# EAGLE design rack_backplane_v9.0 (EAGLE 9.6.2)
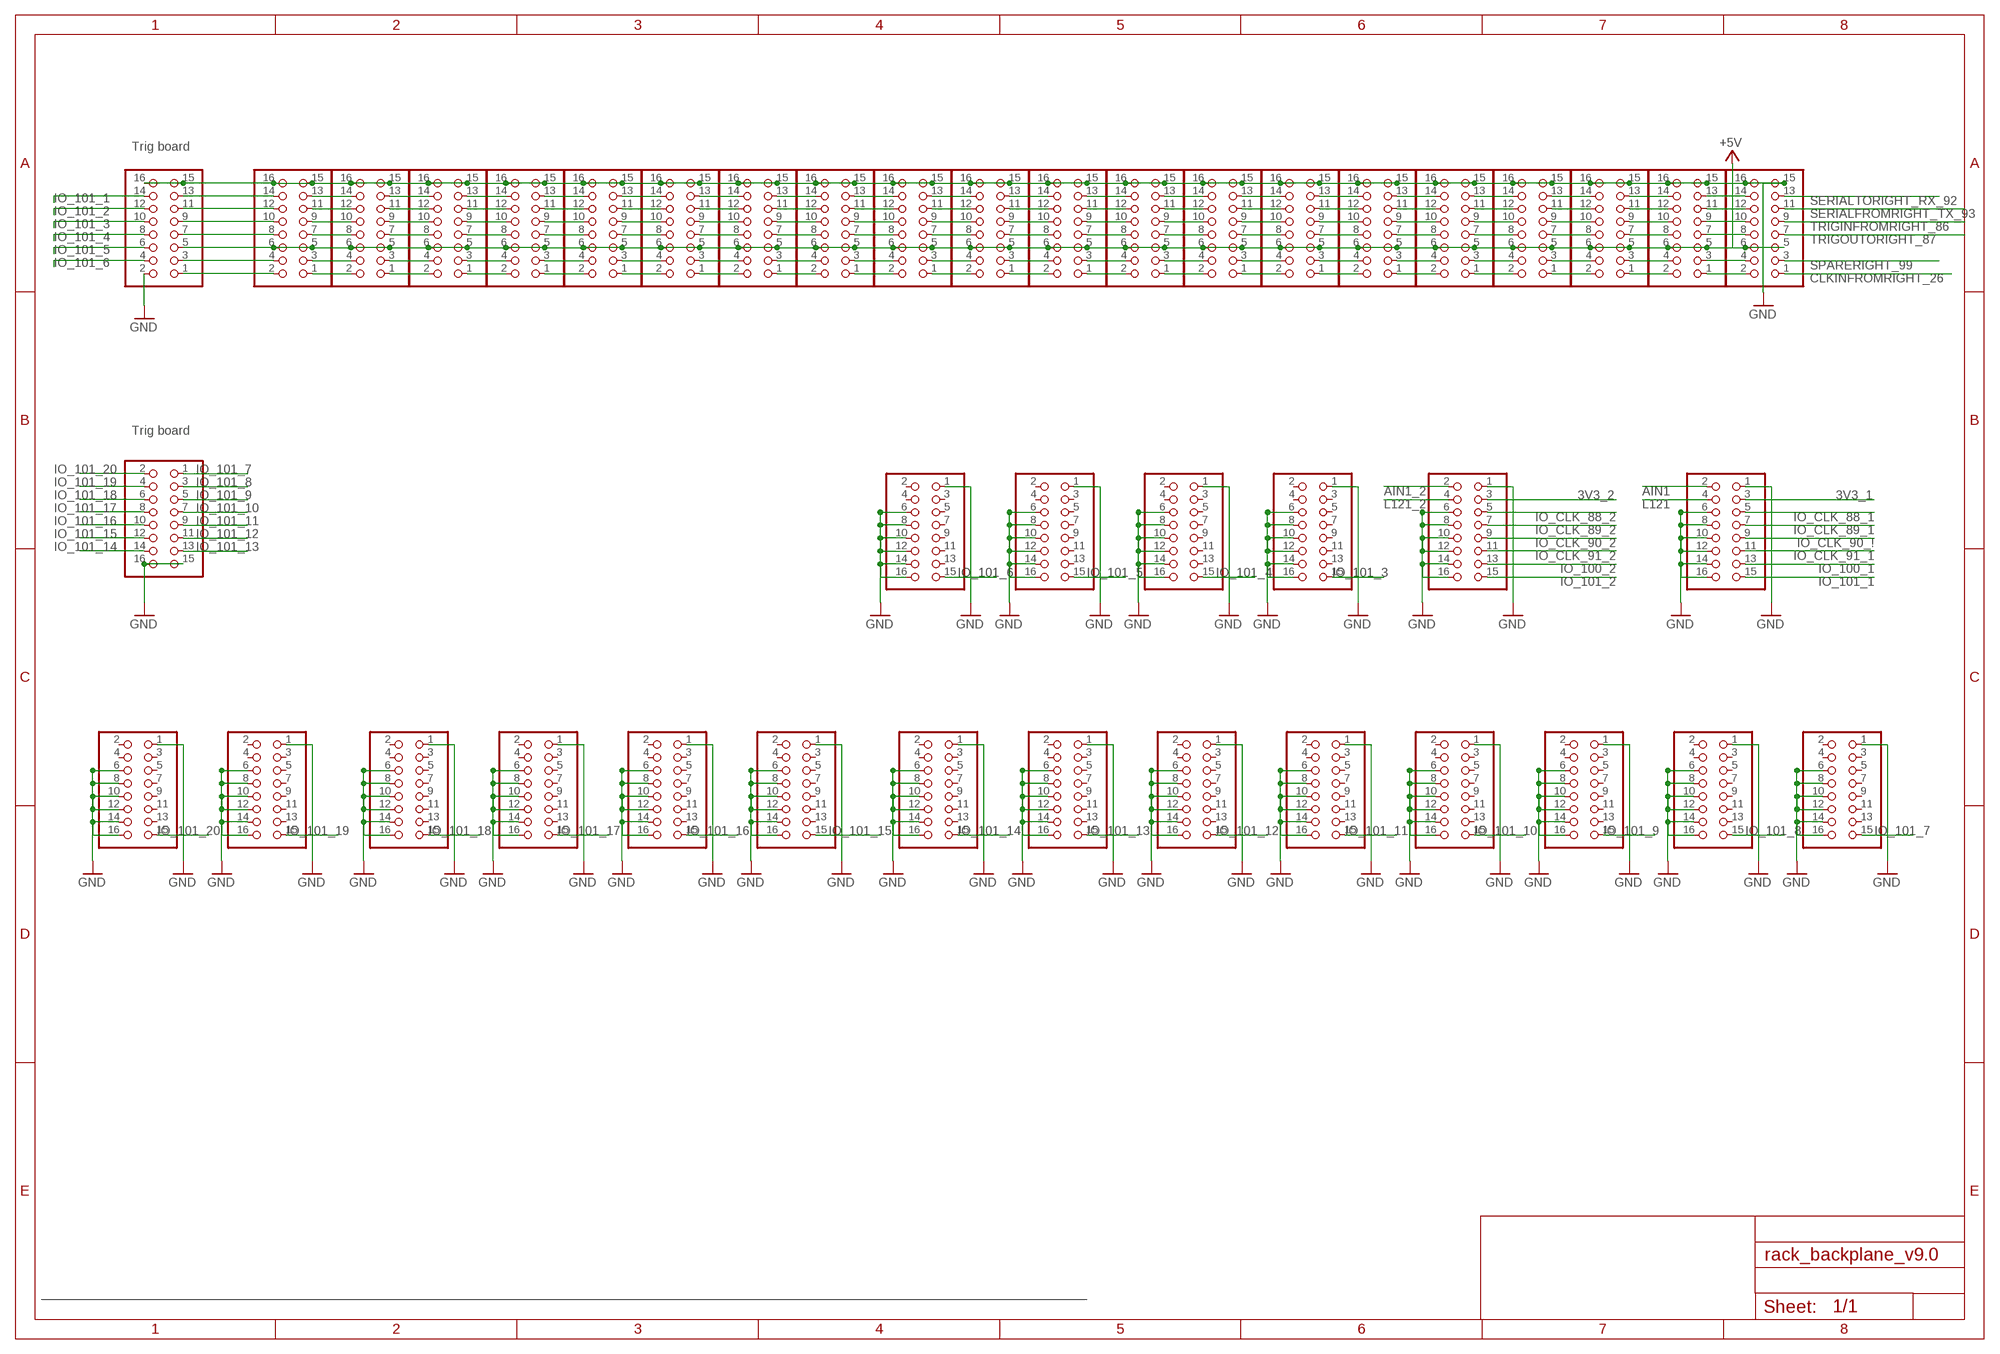
[diagram p0: schematic, sheet 1]

## Parts
PIN_AIN_PWRGND1  15-91-2160  PINHD-2X8  [2X08]
PIN_AIN_PWRGND2  15-91-2160  PINHD-2X8  [2X08]
PIN_AIN_PWRGND3  15-91-2160  PINHD-2X8  [2X08]
PIN_AIN_PWRGND4  15-91-2160  PINHD-2X8  [2X08]
PIN_AIN_PWRGND5  15-91-2160  PINHD-2X8  [2X08]
PIN_AIN_PWRGND6  15-91-2160  PINHD-2X8  [2X08]
PIN_AIN_PWRGND7  15-91-2160  PINHD-2X8  [2X08]
PIN_AIN_PWRGND8  15-91-2160  PINHD-2X8  [2X08]
PIN_AIN_PWRGND9  15-91-2160  PINHD-2X8  [2X08]
PIN_AIN_PWRGND10  15-91-2160  PINHD-2X8  [2X08]
PIN_AIN_PWRGND11  15-91-2160  PINHD-2X8  [2X08]
PIN_AIN_PWRGND12  15-91-2160  PINHD-2X8  [2X08]
PIN_AIN_PWRGND13  15-91-2160  PINHD-2X8  [2X08]
PIN_AIN_PWRGND14  15-91-2160  PINHD-2X8  [2X08]
PIN_AIN_PWRGND15  15-91-2160  PINHD-2X8  [2X08]
PIN_AIN_PWRGND16  15-91-2160  PINHD-2X8  [2X08]
PIN_AIN_PWRGND17  15-91-2160  PINHD-2X8  [2X08]
PIN_AIN_PWRGND18  15-91-2160  PINHD-2X8  [2X08]
PIN_AIN_PWRGND19  15-91-2160  PINHD-2X8  [2X08]
PIN_AIN_PWRGND20  15-91-2160  PINHD-2X8  [2X08]
PIN_AIN_PWRGND21  15-91-2160  PINHD-2X8  [2X08]
PIN_ANALOG_1  15-91-2160  PINHD-2X8  [2X08]
PIN_ANALOG_2  15-91-2160  PINHD-2X8  [2X08]
PIN_ANALOG_3  15-91-2160  PINHD-2X8  [2X08]
PIN_ANALOG_4  15-91-2160  PINHD-2X8  [2X08]
PIN_ANALOG_5  15-91-2160  PINHD-2X8  [2X08]
PIN_ANALOG_6  15-91-2160  PINHD-2X8  [2X08]
PIN_ANALOG_7  15-91-2160  PINHD-2X8  [2X08]
PIN_ANALOG_8  15-91-2160  PINHD-2X8  [2X08]
PIN_ANALOG_9  15-91-2160  PINHD-2X8  [2X08]
PIN_ANALOG_10  15-91-2160  PINHD-2X8  [2X08]
PIN_ANALOG_11  15-91-2160  PINHD-2X8  [2X08]
PIN_ANALOG_12  15-91-2160  PINHD-2X8  [2X08]
PIN_ANALOG_13  15-91-2160  PINHD-2X8  [2X08]
PIN_ANALOG_14  15-91-2160  PINHD-2X8  [2X08]
PIN_ANALOG_15  15-91-2160  PINHD-2X8  [2X08]
PIN_ANALOG_16  15-91-2160  PINHD-2X8  [2X08]
PIN_ANALOG_17  15-91-2160  PINHD-2X8  [2X08]
PIN_ANALOG_18  15-91-2160  PINHD-2X8  [2X08]
PIN_ANALOG_19  15-91-2160  PINHD-2X8  [2X08]
PIN_ANALOG_20  15-91-2160  PINHD-2X8  [2X08]
PIN_ANALOG_21  15-91-2160  PINHD-2X8  [2X08]

## Nets
3V3_1 [three]: PIN_AIN_PWRGND1.3
3V3_2 [three]: PIN_AIN_PWRGND2.3
+5V [five]: PIN_ANALOG_1.5 PIN_ANALOG_1.6 PIN_ANALOG_2.5 PIN_ANALOG_2.6 PIN_ANALOG_3.5 PIN_ANALOG_3.6 PIN_ANALOG_4.5 PIN_ANALOG_4.6 PIN_ANALOG_5.5 PIN_ANALOG_5.6 PIN_ANALOG_6.5 PIN_ANALOG_6.6 PIN_ANALOG_7.5 PIN_ANALOG_7.6 PIN_ANALOG_8.5 PIN_ANALOG_8.6 PIN_ANALOG_9.5 PIN_ANALOG_9.6 PIN_ANALOG_10.5 PIN_ANALOG_10.6 PIN_ANALOG_11.5 PIN_ANALOG_11.6 PIN_ANALOG_12.5 PIN_ANALOG_12.6 PIN_ANALOG_13.5 PIN_ANALOG_13.6 PIN_ANALOG_14.5 PIN_ANALOG_14.6 PIN_ANALOG_15.5 PIN_ANALOG_15.6 PIN_ANALOG_16.5 PIN_ANALOG_16.6 PIN_ANALOG_17.5 PIN_ANALOG_17.6 PIN_ANALOG_18.5 PIN_ANALOG_18.6 PIN_ANALOG_19.5 PIN_ANALOG_19.6 PIN_ANALOG_20.5 PIN_ANALOG_20.6 PIN_ANALOG_21.5
AIN1: PIN_AIN_PWRGND1.2
AIN1_2: PIN_AIN_PWRGND2.2
CLKINFROMRIGHT_26: PIN_ANALOG_1.1
GND [gnd]: PIN_AIN_PWRGND1.1 PIN_AIN_PWRGND1.6 PIN_AIN_PWRGND1.8 PIN_AIN_PWRGND1.10 PIN_AIN_PWRGND1.12 PIN_AIN_PWRGND1.14 PIN_AIN_PWRGND1.16 PIN_AIN_PWRGND2.1 PIN_AIN_PWRGND2.6 PIN_AIN_PWRGND2.8 PIN_AIN_PWRGND2.10 PIN_AIN_PWRGND2.12 PIN_AIN_PWRGND2.14 PIN_AIN_PWRGND2.16 PIN_AIN_PWRGND3.1 PIN_AIN_PWRGND3.6 PIN_AIN_PWRGND3.8 PIN_AIN_PWRGND3.10 PIN_AIN_PWRGND3.12 PIN_AIN_PWRGND3.14 PIN_AIN_PWRGND3.16 PIN_AIN_PWRGND4.1 PIN_AIN_PWRGND4.6 PIN_AIN_PWRGND4.8 PIN_AIN_PWRGND4.10 PIN_AIN_PWRGND4.12 PIN_AIN_PWRGND4.14 PIN_AIN_PWRGND4.16 PIN_AIN_PWRGND5.1 PIN_AIN_PWRGND5.6 PIN_AIN_PWRGND5.8 PIN_AIN_PWRGND5.10 PIN_AIN_PWRGND5.12 PIN_AIN_PWRGND5.14 PIN_AIN_PWRGND5.16 PIN_AIN_PWRGND6.1 PIN_AIN_PWRGND6.6 PIN_AIN_PWRGND6.8 PIN_AIN_PWRGND6.10 PIN_AIN_PWRGND6.12 PIN_AIN_PWRGND6.14 PIN_AIN_PWRGND6.16 PIN_AIN_PWRGND7.1 PIN_AIN_PWRGND7.6 PIN_AIN_PWRGND7.8 PIN_AIN_PWRGND7.10 PIN_AIN_PWRGND7.12 PIN_AIN_PWRGND7.14 PIN_AIN_PWRGND7.16 PIN_AIN_PWRGND8.1 PIN_AIN_PWRGND8.6 PIN_AIN_PWRGND8.8 PIN_AIN_PWRGND8.10 PIN_AIN_PWRGND8.12 PIN_AIN_PWRGND8.14 PIN_AIN_PWRGND8.16 PIN_AIN_PWRGND9.1 PIN_AIN_PWRGND9.6 PIN_AIN_PWRGND9.8 PIN_AIN_PWRGND9.10 PIN_AIN_PWRGND9.12 PIN_AIN_PWRGND9.14 PIN_AIN_PWRGND9.16 PIN_AIN_PWRGND10.1 PIN_AIN_PWRGND10.6 PIN_AIN_PWRGND10.8 PIN_AIN_PWRGND10.10 PIN_AIN_PWRGND10.12 PIN_AIN_PWRGND10.14 PIN_AIN_PWRGND10.16 PIN_AIN_PWRGND11.1 PIN_AIN_PWRGND11.6 PIN_AIN_PWRGND11.8 PIN_AIN_PWRGND11.10 PIN_AIN_PWRGND11.12 PIN_AIN_PWRGND11.14 PIN_AIN_PWRGND11.16 PIN_AIN_PWRGND12.1 PIN_AIN_PWRGND12.6 PIN_AIN_PWRGND12.8 PIN_AIN_PWRGND12.10 PIN_AIN_PWRGND12.12 PIN_AIN_PWRGND12.14 PIN_AIN_PWRGND12.16 PIN_AIN_PWRGND13.1 PIN_AIN_PWRGND13.6 PIN_AIN_PWRGND13.8 PIN_AIN_PWRGND13.10 PIN_AIN_PWRGND13.12 PIN_AIN_PWRGND13.14 PIN_AIN_PWRGND13.16 PIN_AIN_PWRGND14.1 PIN_AIN_PWRGND14.6 PIN_AIN_PWRGND14.8 PIN_AIN_PWRGND14.10 PIN_AIN_PWRGND14.12 PIN_AIN_PWRGND14.14 PIN_AIN_PWRGND14.16 PIN_AIN_PWRGND15.1 PIN_AIN_PWRGND15.6 PIN_AIN_PWRGND15.8 PIN_AIN_PWRGND15.10 PIN_AIN_PWRGND15.12 PIN_AIN_PWRGND15.14 PIN_AIN_PWRGND15.16 PIN_AIN_PWRGND16.1 PIN_AIN_PWRGND16.6 PIN_AIN_PWRGND16.8 PIN_AIN_PWRGND16.10 PIN_AIN_PWRGND16.12 PIN_AIN_PWRGND16.14 PIN_AIN_PWRGND16.16 PIN_AIN_PWRGND17.1 PIN_AIN_PWRGND17.6 PIN_AIN_PWRGND17.8 PIN_AIN_PWRGND17.10 PIN_AIN_PWRGND17.12 PIN_AIN_PWRGND17.14 PIN_AIN_PWRGND17.16 PIN_AIN_PWRGND18.1 PIN_AIN_PWRGND18.6 PIN_AIN_PWRGND18.8 PIN_AIN_PWRGND18.10 PIN_AIN_PWRGND18.12 PIN_AIN_PWRGND18.14 PIN_AIN_PWRGND18.16 PIN_AIN_PWRGND19.1 PIN_AIN_PWRGND19.6 PIN_AIN_PWRGND19.8 PIN_AIN_PWRGND19.10 PIN_AIN_PWRGND19.12 PIN_AIN_PWRGND19.14 PIN_AIN_PWRGND19.16 PIN_AIN_PWRGND20.1 PIN_AIN_PWRGND20.6 PIN_AIN_PWRGND20.8 PIN_AIN_PWRGND20.10 PIN_AIN_PWRGND20.12 PIN_AIN_PWRGND20.14 PIN_AIN_PWRGND20.16 PIN_AIN_PWRGND21.15 PIN_AIN_PWRGND21.16 PIN_ANALOG_1.15 PIN_ANALOG_1.16 PIN_ANALOG_2.15 PIN_ANALOG_2.16 PIN_ANALOG_3.15 PIN_ANALOG_3.16 PIN_ANALOG_4.15 PIN_ANALOG_4.16 PIN_ANALOG_5.15 PIN_ANALOG_5.16 PIN_ANALOG_6.15 PIN_ANALOG_6.16 PIN_ANALOG_7.15 PIN_ANALOG_7.16 PIN_ANALOG_8.15 PIN_ANALOG_8.16 PIN_ANALOG_9.15 PIN_ANALOG_9.16 PIN_ANALOG_10.15 PIN_ANALOG_10.16 PIN_ANALOG_11.15 PIN_ANALOG_11.16 PIN_ANALOG_12.15 PIN_ANALOG_12.16 PIN_ANALOG_13.15 PIN_ANALOG_13.16 PIN_ANALOG_14.15 PIN_ANALOG_14.16 PIN_ANALOG_15.15 PIN_ANALOG_15.16 PIN_ANALOG_16.15 PIN_ANALOG_16.16 PIN_ANALOG_17.15 PIN_ANALOG_17.16 PIN_ANALOG_18.15 PIN_ANALOG_18.16 PIN_ANALOG_19.15 PIN_ANALOG_19.16 PIN_ANALOG_20.15 PIN_ANALOG_20.16 PIN_ANALOG_21.2 PIN_ANALOG_21.15 PIN_ANALOG_21.16
IO_100_1: PIN_AIN_PWRGND1.13
IO_100_2: PIN_AIN_PWRGND2.13
IO_101_1 [50ohm]: PIN_AIN_PWRGND1.15 PIN_ANALOG_21.14
IO_101_2 [50ohm]: PIN_AIN_PWRGND2.15 PIN_ANALOG_21.12
IO_101_3 [50ohm]: PIN_AIN_PWRGND3.15 PIN_ANALOG_21.10
IO_101_4 [50ohm]: PIN_AIN_PWRGND4.15 PIN_ANALOG_21.8
IO_101_5 [50ohm]: PIN_AIN_PWRGND5.15 PIN_ANALOG_21.6
IO_101_6 [50ohm]: PIN_AIN_PWRGND6.15 PIN_ANALOG_21.4
IO_101_7 [50ohm]: PIN_AIN_PWRGND7.15 PIN_AIN_PWRGND21.1
IO_101_8 [50ohm]: PIN_AIN_PWRGND8.15 PIN_AIN_PWRGND21.3
IO_101_9 [50ohm]: PIN_AIN_PWRGND9.15 PIN_AIN_PWRGND21.5
IO_101_10 [50ohm]: PIN_AIN_PWRGND10.15 PIN_AIN_PWRGND21.7
IO_101_11 [50ohm]: PIN_AIN_PWRGND11.15 PIN_AIN_PWRGND21.9
IO_101_12 [50ohm]: PIN_AIN_PWRGND12.15 PIN_AIN_PWRGND21.11
IO_101_13 [50ohm]: PIN_AIN_PWRGND13.15 PIN_AIN_PWRGND21.13
IO_101_14 [50ohm]: PIN_AIN_PWRGND14.15 PIN_AIN_PWRGND21.14
IO_101_15 [50ohm]: PIN_AIN_PWRGND15.15 PIN_AIN_PWRGND21.12
IO_101_16 [50ohm]: PIN_AIN_PWRGND16.15 PIN_AIN_PWRGND21.10
IO_101_17 [50ohm]: PIN_AIN_PWRGND17.15 PIN_AIN_PWRGND21.8
IO_101_18 [50ohm]: PIN_AIN_PWRGND18.15 PIN_AIN_PWRGND21.6
IO_101_19 [50ohm]: PIN_AIN_PWRGND19.15 PIN_AIN_PWRGND21.4
IO_101_20 [50ohm]: PIN_AIN_PWRGND20.15 PIN_AIN_PWRGND21.2
IO_CLK_88_1: PIN_AIN_PWRGND1.5
IO_CLK_88_2: PIN_AIN_PWRGND2.5
IO_CLK_89_1: PIN_AIN_PWRGND1.7
IO_CLK_89_2: PIN_AIN_PWRGND2.7
IO_CLK_90_2: PIN_AIN_PWRGND2.9
IO_CLK_90_!: PIN_AIN_PWRGND1.9
IO_CLK_91_1: PIN_AIN_PWRGND1.11
IO_CLK_91_2: PIN_AIN_PWRGND2.11
L121: PIN_AIN_PWRGND1.4
L121_2: PIN_AIN_PWRGND2.4
N$1: PIN_ANALOG_1.14 PIN_ANALOG_2.13
N$2: PIN_ANALOG_1.12 PIN_ANALOG_2.11
N$3: PIN_ANALOG_1.10 PIN_ANALOG_2.9
N$4: PIN_ANALOG_1.8 PIN_ANALOG_2.7
N$5: PIN_ANALOG_1.4 PIN_ANALOG_2.3
N$6: PIN_ANALOG_1.2 PIN_ANALOG_2.1
N$7: PIN_ANALOG_2.2 PIN_ANALOG_3.1
N$8: PIN_ANALOG_2.4 PIN_ANALOG_3.3
N$10: PIN_ANALOG_2.8 PIN_ANALOG_3.7
N$11: PIN_ANALOG_2.10 PIN_ANALOG_3.9
N$12: PIN_ANALOG_2.12 PIN_ANALOG_3.11
N$13: PIN_ANALOG_2.14 PIN_ANALOG_3.13
N$15: PIN_ANALOG_3.2 PIN_ANALOG_4.1
N$16: PIN_ANALOG_3.4 PIN_ANALOG_4.3
N$19: PIN_ANALOG_3.8 PIN_ANALOG_4.7
N$20: PIN_ANALOG_3.10 PIN_ANALOG_4.9
N$21: PIN_ANALOG_3.12 PIN_ANALOG_4.11
N$22: PIN_ANALOG_3.14 PIN_ANALOG_4.13
N$24: PIN_ANALOG_4.2 PIN_ANALOG_5.1
N$25: PIN_ANALOG_4.4 PIN_ANALOG_5.3
N$27: PIN_ANALOG_4.8 PIN_ANALOG_5.7
N$28: PIN_ANALOG_4.10 PIN_ANALOG_5.9
N$29: PIN_ANALOG_4.12 PIN_ANALOG_5.11
N$30: PIN_ANALOG_4.14 PIN_ANALOG_5.13
N$32: PIN_ANALOG_5.2 PIN_ANALOG_6.1
N$33: PIN_ANALOG_5.4 PIN_ANALOG_6.3
N$35: PIN_ANALOG_5.8 PIN_ANALOG_6.7
N$36: PIN_ANALOG_5.10 PIN_ANALOG_6.9
N$37: PIN_ANALOG_5.12 PIN_ANALOG_6.11
N$38: PIN_ANALOG_5.14 PIN_ANALOG_6.13
N$40: PIN_ANALOG_6.2 PIN_ANALOG_7.1
N$41: PIN_ANALOG_6.4 PIN_ANALOG_7.3
N$43: PIN_ANALOG_6.8 PIN_ANALOG_7.7
N$44: PIN_ANALOG_6.10 PIN_ANALOG_7.9
N$45: PIN_ANALOG_6.12 PIN_ANALOG_7.11
N$46: PIN_ANALOG_6.14 PIN_ANALOG_7.13
N$48: PIN_ANALOG_7.2 PIN_ANALOG_8.1
N$49: PIN_ANALOG_7.4 PIN_ANALOG_8.3
N$51: PIN_ANALOG_7.8 PIN_ANALOG_8.7
N$52: PIN_ANALOG_7.10 PIN_ANALOG_8.9
N$53: PIN_ANALOG_7.12 PIN_ANALOG_8.11
N$54: PIN_ANALOG_7.14 PIN_ANALOG_8.13
N$56: PIN_ANALOG_8.2 PIN_ANALOG_9.1
N$57: PIN_ANALOG_8.4 PIN_ANALOG_9.3
N$59: PIN_ANALOG_8.8 PIN_ANALOG_9.7
N$60: PIN_ANALOG_8.10 PIN_ANALOG_9.9
N$61: PIN_ANALOG_8.12 PIN_ANALOG_9.11
N$62: PIN_ANALOG_8.14 PIN_ANALOG_9.13
N$64: PIN_ANALOG_9.2 PIN_ANALOG_10.1
N$65: PIN_ANALOG_9.4 PIN_ANALOG_10.3
N$67: PIN_ANALOG_9.8 PIN_ANALOG_10.7
N$68: PIN_ANALOG_9.10 PIN_ANALOG_10.9
N$69: PIN_ANALOG_9.12 PIN_ANALOG_10.11
N$70: PIN_ANALOG_9.14 PIN_ANALOG_10.13
N$72: PIN_ANALOG_10.2 PIN_ANALOG_11.1
N$73: PIN_ANALOG_10.4 PIN_ANALOG_11.3
N$75: PIN_ANALOG_10.8 PIN_ANALOG_11.7
N$76: PIN_ANALOG_10.10 PIN_ANALOG_11.9
N$77: PIN_ANALOG_10.12 PIN_ANALOG_11.11
N$78: PIN_ANALOG_10.14 PIN_ANALOG_11.13
N$80: PIN_ANALOG_11.2 PIN_ANALOG_12.1
N$81: PIN_ANALOG_11.4 PIN_ANALOG_12.3
N$83: PIN_ANALOG_11.8 PIN_ANALOG_12.7
N$84: PIN_ANALOG_11.10 PIN_ANALOG_12.9
N$85: PIN_ANALOG_11.12 PIN_ANALOG_12.11
N$86: PIN_ANALOG_11.14 PIN_ANALOG_12.13
N$88: PIN_ANALOG_12.2 PIN_ANALOG_13.1
N$89: PIN_ANALOG_12.4 PIN_ANALOG_13.3
N$91: PIN_ANALOG_12.8 PIN_ANALOG_13.7
N$92: PIN_ANALOG_12.10 PIN_ANALOG_13.9
N$93: PIN_ANALOG_12.12 PIN_ANALOG_13.11
N$94: PIN_ANALOG_12.14 PIN_ANALOG_13.13
N$96: PIN_ANALOG_13.2 PIN_ANALOG_14.1
N$97: PIN_ANALOG_13.4 PIN_ANALOG_14.3
N$99: PIN_ANALOG_13.8 PIN_ANALOG_14.7
N$100: PIN_ANALOG_13.10 PIN_ANALOG_14.9
N$101: PIN_ANALOG_13.12 PIN_ANALOG_14.11
N$102: PIN_ANALOG_13.14 PIN_ANALOG_14.13
N$104: PIN_ANALOG_14.2 PIN_ANALOG_15.1
N$105: PIN_ANALOG_14.4 PIN_ANALOG_15.3
N$107: PIN_ANALOG_14.8 PIN_ANALOG_15.7
N$108: PIN_ANALOG_14.10 PIN_ANALOG_15.9
N$109: PIN_ANALOG_14.12 PIN_ANALOG_15.11
N$110: PIN_ANALOG_14.14 PIN_ANALOG_15.13
N$112: PIN_ANALOG_15.2 PIN_ANALOG_16.1
N$113: PIN_ANALOG_15.4 PIN_ANALOG_16.3
N$115: PIN_ANALOG_15.8 PIN_ANALOG_16.7
N$116: PIN_ANALOG_15.10 PIN_ANALOG_16.9
N$117: PIN_ANALOG_15.12 PIN_ANALOG_16.11
N$118: PIN_ANALOG_15.14 PIN_ANALOG_16.13
N$120: PIN_ANALOG_16.2 PIN_ANALOG_17.1
N$121: PIN_ANALOG_16.4 PIN_ANALOG_17.3
N$123: PIN_ANALOG_16.8 PIN_ANALOG_17.7
N$124: PIN_ANALOG_16.10 PIN_ANALOG_17.9
N$125: PIN_ANALOG_16.12 PIN_ANALOG_17.11
N$126: PIN_ANALOG_16.14 PIN_ANALOG_17.13
N$128: PIN_ANALOG_17.2 PIN_ANALOG_18.1
N$129: PIN_ANALOG_17.4 PIN_ANALOG_18.3
N$131: PIN_ANALOG_17.8 PIN_ANALOG_18.7
N$132: PIN_ANALOG_17.10 PIN_ANALOG_18.9
N$133: PIN_ANALOG_17.12 PIN_ANALOG_18.11
N$134: PIN_ANALOG_17.14 PIN_ANALOG_18.13
N$136: PIN_ANALOG_18.2 PIN_ANALOG_19.1
N$137: PIN_ANALOG_18.4 PIN_ANALOG_19.3
N$139: PIN_ANALOG_18.8 PIN_ANALOG_19.7
N$140: PIN_ANALOG_18.10 PIN_ANALOG_19.9
N$141: PIN_ANALOG_18.12 PIN_ANALOG_19.11
N$142: PIN_ANALOG_18.14 PIN_ANALOG_19.13
N$144: PIN_ANALOG_19.2 PIN_ANALOG_20.1
N$145: PIN_ANALOG_19.4 PIN_ANALOG_20.3
N$147: PIN_ANALOG_19.8 PIN_ANALOG_20.7
N$148: PIN_ANALOG_19.10 PIN_ANALOG_20.9
N$149: PIN_ANALOG_19.12 PIN_ANALOG_20.11
N$150: PIN_ANALOG_19.14 PIN_ANALOG_20.13
N$152: PIN_ANALOG_20.2 PIN_ANALOG_21.1
N$153: PIN_ANALOG_20.4 PIN_ANALOG_21.3
N$155: PIN_ANALOG_20.8 PIN_ANALOG_21.7
N$156: PIN_ANALOG_20.10 PIN_ANALOG_21.9
N$157: PIN_ANALOG_20.12 PIN_ANALOG_21.11
N$158: PIN_ANALOG_20.14 PIN_ANALOG_21.13
SERIALFROMRIGHT_TX_93: PIN_ANALOG_1.11
SERIALTORIGHT_RX_92: PIN_ANALOG_1.13
SPARERIGHT_99: PIN_ANALOG_1.3
TRIGINFROMRIGHT_86: PIN_ANALOG_1.9
TRIGOUTORIGHT_87: PIN_ANALOG_1.7
Unconnected: PIN_AIN_PWRGND3.2 PIN_AIN_PWRGND3.3 PIN_AIN_PWRGND3.4 PIN_AIN_PWRGND3.5 PIN_AIN_PWRGND3.7 PIN_AIN_PWRGND3.9 PIN_AIN_PWRGND3.11 PIN_AIN_PWRGND3.13 PIN_AIN_PWRGND4.2 PIN_AIN_PWRGND4.3 PIN_AIN_PWRGND4.4 PIN_AIN_PWRGND4.5 PIN_AIN_PWRGND4.7 PIN_AIN_PWRGND4.9 PIN_AIN_PWRGND4.11 PIN_AIN_PWRGND4.13 PIN_AIN_PWRGND5.2 PIN_AIN_PWRGND5.3 PIN_AIN_PWRGND5.4 PIN_AIN_PWRGND5.5 PIN_AIN_PWRGND5.7 PIN_AIN_PWRGND5.9 PIN_AIN_PWRGND5.11 PIN_AIN_PWRGND5.13 PIN_AIN_PWRGND6.2 PIN_AIN_PWRGND6.3 PIN_AIN_PWRGND6.4 PIN_AIN_PWRGND6.5 PIN_AIN_PWRGND6.7 PIN_AIN_PWRGND6.9 PIN_AIN_PWRGND6.11 PIN_AIN_PWRGND6.13 PIN_AIN_PWRGND7.2 PIN_AIN_PWRGND7.3 PIN_AIN_PWRGND7.4 PIN_AIN_PWRGND7.5 PIN_AIN_PWRGND7.7 PIN_AIN_PWRGND7.9 PIN_AIN_PWRGND7.11 PIN_AIN_PWRGND7.13 PIN_AIN_PWRGND8.2 PIN_AIN_PWRGND8.3 PIN_AIN_PWRGND8.4 PIN_AIN_PWRGND8.5 PIN_AIN_PWRGND8.7 PIN_AIN_PWRGND8.9 PIN_AIN_PWRGND8.11 PIN_AIN_PWRGND8.13 PIN_AIN_PWRGND9.2 PIN_AIN_PWRGND9.3 PIN_AIN_PWRGND9.4 PIN_AIN_PWRGND9.5 PIN_AIN_PWRGND9.7 PIN_AIN_PWRGND9.9 PIN_AIN_PWRGND9.11 PIN_AIN_PWRGND9.13 PIN_AIN_PWRGND10.2 PIN_AIN_PWRGND10.3 PIN_AIN_PWRGND10.4 PIN_AIN_PWRGND10.5 PIN_AIN_PWRGND10.7 PIN_AIN_PWRGND10.9 PIN_AIN_PWRGND10.11 PIN_AIN_PWRGND10.13 PIN_AIN_PWRGND11.2 PIN_AIN_PWRGND11.3 PIN_AIN_PWRGND11.4 PIN_AIN_PWRGND11.5 PIN_AIN_PWRGND11.7 PIN_AIN_PWRGND11.9 PIN_AIN_PWRGND11.11 PIN_AIN_PWRGND11.13 PIN_AIN_PWRGND12.2 PIN_AIN_PWRGND12.3 PIN_AIN_PWRGND12.4 PIN_AIN_PWRGND12.5 PIN_AIN_PWRGND12.7 PIN_AIN_PWRGND12.9 PIN_AIN_PWRGND12.11 PIN_AIN_PWRGND12.13 PIN_AIN_PWRGND13.2 PIN_AIN_PWRGND13.3 PIN_AIN_PWRGND13.4 PIN_AIN_PWRGND13.5 PIN_AIN_PWRGND13.7 PIN_AIN_PWRGND13.9 PIN_AIN_PWRGND13.11 PIN_AIN_PWRGND13.13 PIN_AIN_PWRGND14.2 PIN_AIN_PWRGND14.3 PIN_AIN_PWRGND14.4 PIN_AIN_PWRGND14.5 PIN_AIN_PWRGND14.7 PIN_AIN_PWRGND14.9 PIN_AIN_PWRGND14.11 PIN_AIN_PWRGND14.13 PIN_AIN_PWRGND15.2 PIN_AIN_PWRGND15.3 PIN_AIN_PWRGND15.4 PIN_AIN_PWRGND15.5 PIN_AIN_PWRGND15.7 PIN_AIN_PWRGND15.9 PIN_AIN_PWRGND15.11 PIN_AIN_PWRGND15.13 PIN_AIN_PWRGND16.2 PIN_AIN_PWRGND16.3 PIN_AIN_PWRGND16.4 PIN_AIN_PWRGND16.5 PIN_AIN_PWRGND16.7 PIN_AIN_PWRGND16.9 PIN_AIN_PWRGND16.11 PIN_AIN_PWRGND16.13 PIN_AIN_PWRGND17.2 PIN_AIN_PWRGND17.3 PIN_AIN_PWRGND17.4 PIN_AIN_PWRGND17.5 PIN_AIN_PWRGND17.7 PIN_AIN_PWRGND17.9 PIN_AIN_PWRGND17.11 PIN_AIN_PWRGND17.13 PIN_AIN_PWRGND18.2 PIN_AIN_PWRGND18.3 PIN_AIN_PWRGND18.4 PIN_AIN_PWRGND18.5 PIN_AIN_PWRGND18.7 PIN_AIN_PWRGND18.9 PIN_AIN_PWRGND18.11 PIN_AIN_PWRGND18.13 PIN_AIN_PWRGND19.2 PIN_AIN_PWRGND19.3 PIN_AIN_PWRGND19.4 PIN_AIN_PWRGND19.5 PIN_AIN_PWRGND19.7 PIN_AIN_PWRGND19.9 PIN_AIN_PWRGND19.11 PIN_AIN_PWRGND19.13 PIN_AIN_PWRGND20.2 PIN_AIN_PWRGND20.3 PIN_AIN_PWRGND20.4 PIN_AIN_PWRGND20.5 PIN_AIN_PWRGND20.7 PIN_AIN_PWRGND20.9 PIN_AIN_PWRGND20.11 PIN_AIN_PWRGND20.13

## Notes on the sheet
- Trig board
- Trig board

## Library data of the parts
PIN_AIN_PWRGND1-PIN_AIN_PWRGND21 PIN_ANALOG_1-PIN_ANALOG_21 = pinhead:PINHD-2X8: PIN HEADER; MPN: 15-91-2160

## Net classes
0 default: width 0.152 mm
1 gnd: width 0.305 mm
2 three: width 0.152 mm
3 five: width 0.381 mm
4 50ohm: width 0.254 mm, clearance 0.254 mm to class 0, clearance 0.254 mm to class 1, clearance 0.254 mm to class 2, clearance 0.254 mm to class 3, clearance 0.254 mm

## Board
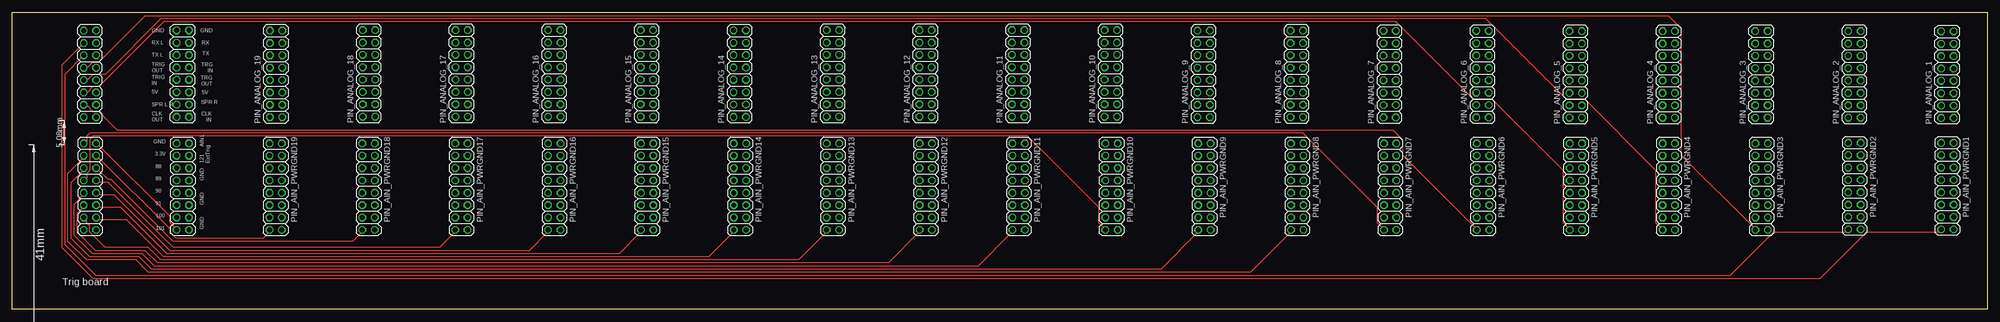
[diagram p1: board, top side]
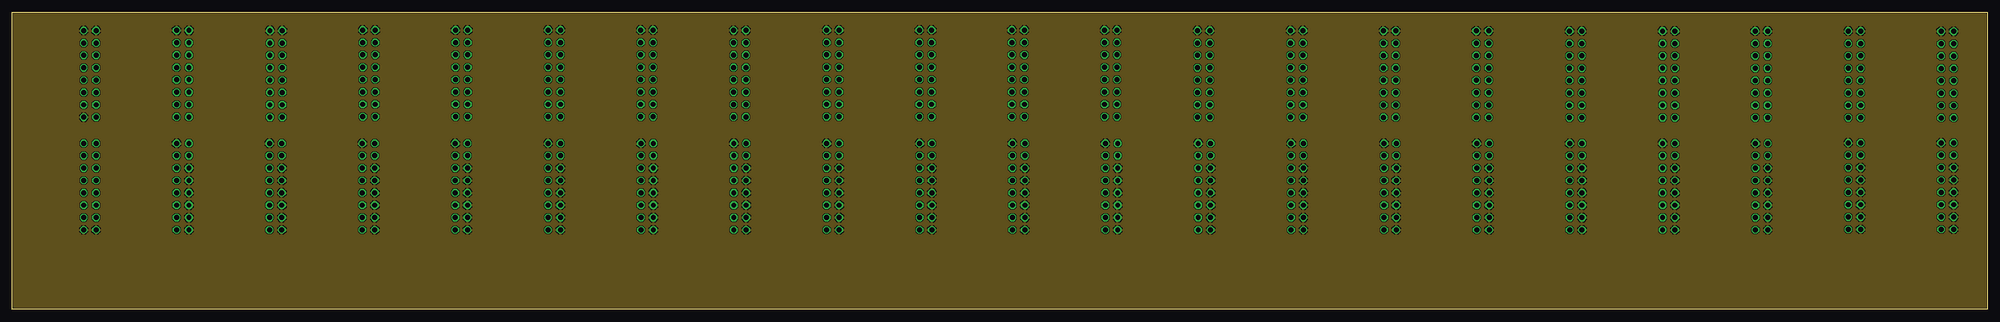
[diagram p2: board, inner layer Route2]
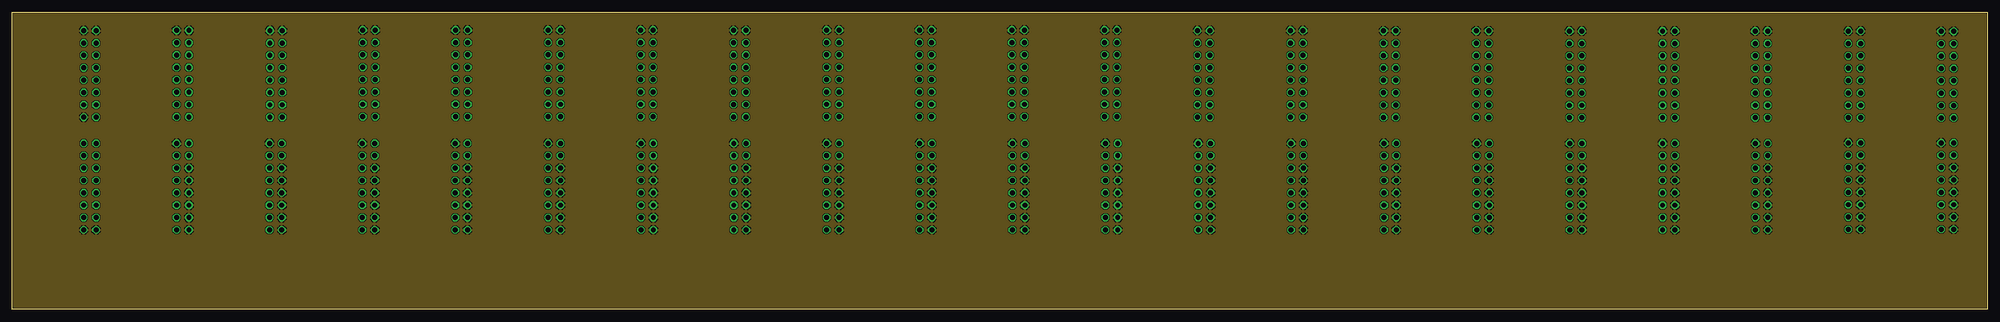
[diagram p3: board, inner layer Route15]
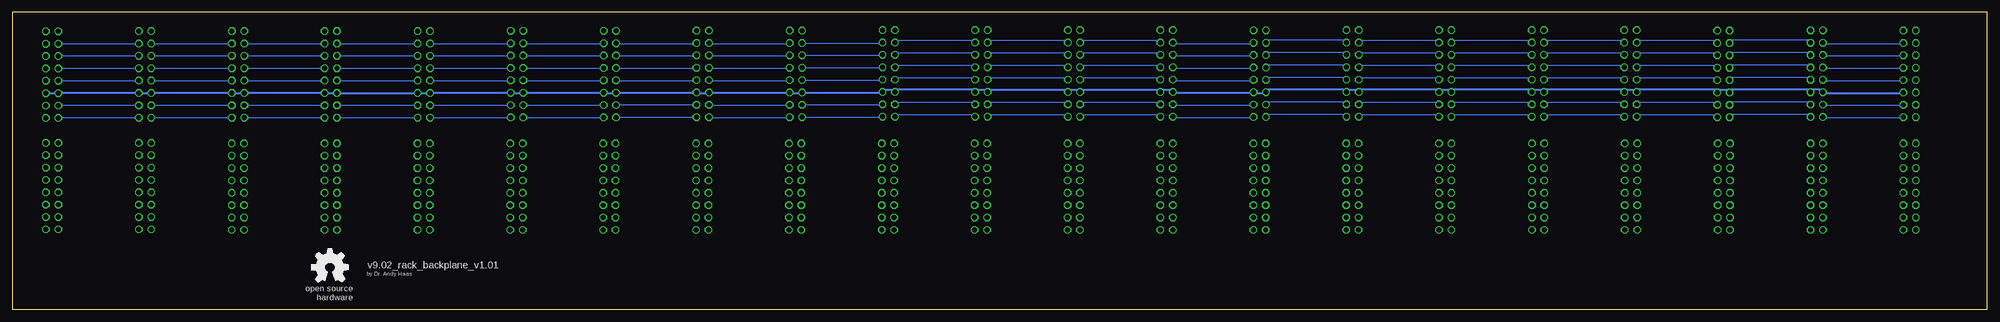
[diagram p4: board, bottom side, seen from below]

Size 405.13 x 61.04 mm. Coordinates in mm from the lower left corner, seen from the top.
Outline: 0,0 0,61.04 405.13,61.04 405.13,0 0,0
Copper layers (1*2*15*16): Top 0.035mm / dielectric 0.2mm / Route2 0.0175mm / dielectric 0.3mm / Route15 0.0175mm / dielectric 0.2mm / Bottom 0.035mm
Design rules "Seeed_AllPCB_MacroFab_haas6mil": minimum track width 6mil, minimum drill 12mil, track to track 6mil, track to pad 6mil, pad to pad 6mil, via to via 6mil, smd to smd 0mil, copper to edge 6mil, drill to drill 6mil, minimum pad ring 6mil, minimum via ring 6mil, stop-mask expansion 6mil, vias tented up to drill 25mil, thermal gap 10mil

### Footprints (pad centres in the part's own frame; a part is rotated, then mirrored left to right if it is on the bottom)
2X08 = drill 1.016 octagon: 1 -8.89,-1.27; 2 -8.89,1.27; 3 -6.35,-1.27; 4 -6.35,1.27; 5 -3.81,-1.27; 6 -3.81,1.27; 7 -1.27,-1.27; 8 -1.27,1.27; 9 1.27,-1.27; 10 1.27,1.27; 11 3.81,-1.27; 12 3.81,1.27; 13 6.35,-1.27; 14 6.35,1.27; 15 8.89,-1.27; 16 8.89,1.27

### Placement (x,y rotation side)
GOLD_ORB_SM1  OSHWLOGOLOGO8MM  [OSHW_8MM]  339.99,8.61 0 bottom
PIN_AIN_PWRGND1  396.94,25.31 270 top
PIN_AIN_PWRGND2  377.89,25.31 270 top
PIN_AIN_PWRGND3  358.84,25.21 270 top
PIN_AIN_PWRGND4  339.79,25.21 270 top
PIN_AIN_PWRGND5  320.74,25.21 270 top
PIN_AIN_PWRGND6  301.69,25.21 270 top
PIN_AIN_PWRGND7  282.64,25.21 270 top
PIN_AIN_PWRGND8  263.59,25.21 270 top
PIN_AIN_PWRGND9  244.54,25.21 270 top
PIN_AIN_PWRGND10  225.49,25.21 270 top
PIN_AIN_PWRGND11  206.44,25.21 270 top
PIN_AIN_PWRGND12  187.39,25.21 270 top
PIN_AIN_PWRGND13  168.34,25.21 270 top
PIN_AIN_PWRGND14  149.29,25.21 270 top
PIN_AIN_PWRGND15  130.24,25.21 270 top
PIN_AIN_PWRGND16  111.19,25.21 270 top
PIN_AIN_PWRGND17  92.14,25.21 270 top
PIN_AIN_PWRGND18  73.09,25.21 270 top
PIN_AIN_PWRGND19  54.04,25.21 270 top
PIN_AIN_PWRGND20  34.99,25.21 270 top
PIN_AIN_PWRGND21  15.94,25.21 270 top
PIN_ANALOG_1  396.94,48.21 90 top
PIN_ANALOG_2  377.89,48.26 90 top
PIN_ANALOG_3  358.79,48.26 90 top
PIN_ANALOG_4  339.79,48.26 90 top
PIN_ANALOG_5  320.69,48.26 90 top
PIN_ANALOG_6  301.59,48.31 90 top
PIN_ANALOG_7  282.54,48.31 90 top
PIN_ANALOG_8  263.49,48.36 90 top
PIN_ANALOG_9  244.39,48.36 90 top
PIN_ANALOG_10  225.34,48.46 90 top
PIN_ANALOG_11  206.34,48.46 90 top
PIN_ANALOG_12  187.34,48.46 90 top
PIN_ANALOG_13  168.34,48.46 90 top
PIN_ANALOG_14  149.24,48.41 90 top
PIN_ANALOG_15  130.19,48.46 90 top
PIN_ANALOG_16  111.19,48.46 90 top
PIN_ANALOG_17  92.19,48.46 90 top
PIN_ANALOG_18  73.19,48.46 90 top
PIN_ANALOG_19  54.14,48.36 90 top
PIN_ANALOG_20  34.99,48.41 90 top
PIN_ANALOG_21  15.94,48.36 90 top

### Tracks (layer width: path | path; a pad name or v marks a point on that pad's centre or on a via)
+5V
  Bottom 0.381: PIN_ANALOG_21.5 17.78,44.45 33.65,44.45 PIN_ANALOG_20.6 34.29,45.09 36.19,45.09 PIN_ANALOG_20.5 36.83,45.09 52.7,45.09 PIN_ANALOG_19.6 53.34,45.09 55.25,45.09 PIN_ANALOG_19.5 55.88,45.09 71.75,45.09 PIN_ANALOG_18.6 72.39,45.09 74.29,45.09 PIN_ANALOG_18.5 74.93,45.09 90.81,45.09 PIN_ANALOG_17.6 91.44,45.09 93.34,45.09 PIN_ANALOG_17.5 93.98,45.09 109.85,45.09 PIN_ANALOG_16.6 110.49,45.09 112.4,45.09 PIN_ANALOG_16.5 113.03,45.09 128.91,45.09 PIN_ANALOG_15.6 129.54,45.09 131.44,45.09 PIN_ANALOG_15.5 132.08,45.09 147.95,45.09 PIN_ANALOG_14.6 148.59,44.45 150.5,44.45 PIN_ANALOG_14.5 151.13,44.45 167,44.45 PIN_ANALOG_13.6 167.64,45.09 169.54,45.09 PIN_ANALOG_13.5 170.18,45.09 186.06,45.09 PIN_ANALOG_12.6 186.69,45.09 188.59,45.09 PIN_ANALOG_12.5 189.23,45.09 204.47,45.09 PIN_ANALOG_11.6 205.11,45.09 207.01,45.09 PIN_ANALOG_11.5 207.64,45.09 223.52,45.09 PIN_ANALOG_10.6 224.16,45.09 226.06,45.09 PIN_ANALOG_10.5 226.69,44.45 242.57,44.45 PIN_ANALOG_9.6 243.2,44.45 245.11,44.45 PIN_ANALOG_9.5 245.75,44.45 261.62,44.45 PIN_ANALOG_8.6 262.25,44.45 264.16,44.45 PIN_ANALOG_8.5 264.8,44.45 280.67,44.45 PIN_ANALOG_7.6 281.31,44.45 283.21,44.45 PIN_ANALOG_7.5 283.85,44.45 299.72,44.45 PIN_ANALOG_6.6 300.36,44.45 302.26,44.45 PIN_ANALOG_6.5 302.89,44.45 PIN_ANALOG_5.6 PIN_ANALOG_5.5 PIN_ANALOG_4.6 PIN_ANALOG_4.5 PIN_ANALOG_3.6 PIN_ANALOG_3.5 PIN_ANALOG_2.6 PIN_ANALOG_2.5 395.61,44.45 PIN_ANALOG_1.6 396.24,44.45 398.14,44.45 PIN_ANALOG_1.5
GND
  pour Route2: -7.71,-2.84 -7.71,69.16 407.04,69.16 407.04,-2.84
  pour Route15: -4.32,-9.19 -4.32,65.28 413.39,65.28 413.39,-9.19
IO_101_1
  Top 0.254: PIN_AIN_PWRGND1.15 395.61,15.88 380.37,15.88 370.84,6.35 16.51,6.35 10.16,12.7 10.16,50.16 14.61,54.61 PIN_ANALOG_21.14
IO_101_2
  Top 0.254: PIN_AIN_PWRGND2.15 376.56,15.88 361.31,15.88 352.43,6.98 17.14,6.98 10.8,13.34 10.8,48.26 14.61,52.07 PIN_ANALOG_21.12
IO_101_3
  Top 0.254: PIN_AIN_PWRGND3.15 357.5,16.51 342.26,31.75 342.26,57.79 339.73,60.33 27.31,60.33 17.78,50.8 16.51,50.8 15.24,49.53 PIN_ANALOG_21.10
IO_101_4
  Top 0.254: PIN_ANALOG_21.8 15.24,46.99 16.51,48.26 19.05,48.26 30.48,59.69 302.26,59.69 318.77,43.18 322.58,43.18 337.19,28.57 337.19,17.78 338.45,16.51 PIN_AIN_PWRGND4.15
IO_101_5
  Top 0.254: PIN_ANALOG_21.6 15.24,44.45 16.51,45.72 17.78,45.72 31.12,59.05 283.85,59.05 299.72,43.18 303.53,43.18 318.13,28.57 318.13,17.78 319.4,16.51 PIN_AIN_PWRGND5.15
IO_101_6
  Top 0.254: PIN_AIN_PWRGND6.15 300.36,16.51 285.12,31.75 285.12,34.92 283.21,36.83 21.59,36.83 17.78,40.64 16.51,40.64 15.24,41.91 PIN_ANALOG_21.4
IO_101_7
  Top 0.254: PIN_AIN_PWRGND21.1 15.24,34.29 15.24,35.56 15.88,36.2 264.8,36.2 280.03,20.95 280.03,17.78 281.31,16.51 PIN_AIN_PWRGND7.15
IO_101_8
  Top 0.254: PIN_AIN_PWRGND21.3 14.61,31.11 11.43,27.94 11.43,13.97 15.24,10.16 25.4,10.16 27.94,7.62 254,7.62 262.25,15.88 PIN_AIN_PWRGND8.15
IO_101_9
  Top 0.254: PIN_AIN_PWRGND21.5 14.61,28.57 12.06,26.04 12.06,14.61 15.88,10.79 26.04,10.79 28.57,8.26 235.58,8.26 243.2,15.88 PIN_AIN_PWRGND9.15
IO_101_10
  Top 0.254: PIN_AIN_PWRGND21.7 15.24,26.67 15.24,27.94 15.88,28.57 15.88,34.92 16.51,35.56 208.28,35.56 222.88,20.95 222.88,17.78 224.16,16.51 PIN_AIN_PWRGND10.15
IO_101_11
  Top 0.254: PIN_AIN_PWRGND21.9 14.61,23.49 12.7,21.59 12.7,15.24 16.51,11.43 26.67,11.43 29.21,8.89 198.12,8.89 205.11,15.88 PIN_AIN_PWRGND11.15
IO_101_12
  Top 0.254: PIN_AIN_PWRGND21.11 14.61,20.95 13.33,19.68 13.33,15.88 17.14,12.07 27.31,12.07 29.84,9.53 179.7,9.53 186.06,15.88 PIN_AIN_PWRGND12.15
IO_101_13
  Top 0.254: PIN_AIN_PWRGND21.13 15.24,18.41 15.24,17.78 15.88,17.14 15.88,15.88 19.05,12.7 27.94,12.7 30.48,10.16 161.29,10.16 167,15.88 PIN_AIN_PWRGND13.15
IO_101_14
  Top 0.254: PIN_AIN_PWRGND21.14 17.78,18.41 23.5,18.41 31.12,10.79 142.88,10.79 147.95,15.88 PIN_AIN_PWRGND14.15
IO_101_15
  Top 0.254: PIN_AIN_PWRGND21.12 17.78,20.95 22.23,20.95 31.75,11.43 124.46,11.43 128.91,15.88 PIN_AIN_PWRGND15.15
IO_101_16
  Top 0.254: PIN_AIN_PWRGND21.10 17.78,23.49 20.95,23.49 32.38,12.07 106.04,12.07 109.85,15.88 PIN_AIN_PWRGND16.15
IO_101_17
  Top 0.254: PIN_AIN_PWRGND21.8 17.78,26.04 19.69,26.04 33.02,12.7 87.63,12.7 90.81,15.88 PIN_AIN_PWRGND17.15
IO_101_18
  Top 0.254: PIN_AIN_PWRGND21.6 17.78,28.57 19.69,26.67 20.32,26.67 33.02,13.97 69.85,13.97 71.75,15.88 PIN_AIN_PWRGND18.15
IO_101_19
  Top 0.254: PIN_AIN_PWRGND21.4 17.78,31.11 32.38,16.51 32.38,15.88 33.65,14.61 51.44,14.61 52.7,15.88 PIN_AIN_PWRGND19.15
IO_101_20
  Top 0.254: PIN_AIN_PWRGND21.2 17.78,33.66 32.38,19.05 32.38,17.78 33.65,16.51 PIN_AIN_PWRGND20.15
N$1
  Bottom 0.152: PIN_ANALOG_2.13 395.61,54.61 PIN_ANALOG_1.14
N$2
  Bottom 0.152: PIN_ANALOG_2.11 395.61,52.07 PIN_ANALOG_1.12
N$3
  Bottom 0.152: PIN_ANALOG_2.9 395.61,49.53 PIN_ANALOG_1.10
N$4
  Bottom 0.152: PIN_ANALOG_2.7 395.61,46.99 PIN_ANALOG_1.8
N$5
  Bottom 0.152: PIN_ANALOG_2.3 395.61,41.91 PIN_ANALOG_1.4
N$6
  Bottom 0.152: PIN_ANALOG_2.1 395.61,39.37 PIN_ANALOG_1.2
N$7
  Bottom 0.152: PIN_ANALOG_2.2 PIN_ANALOG_3.1
N$8
  Bottom 0.152: PIN_ANALOG_2.4 PIN_ANALOG_3.3
N$10
  Bottom 0.152: PIN_ANALOG_2.8 PIN_ANALOG_3.7
N$11
  Bottom 0.152: PIN_ANALOG_2.10 PIN_ANALOG_3.9
N$12
  Bottom 0.152: PIN_ANALOG_2.12 PIN_ANALOG_3.11
N$13
  Bottom 0.152: PIN_ANALOG_2.14 PIN_ANALOG_3.13
N$15
  Bottom 0.152: PIN_ANALOG_3.2 PIN_ANALOG_4.1
N$16
  Bottom 0.152: PIN_ANALOG_3.4 PIN_ANALOG_4.3
N$19
  Bottom 0.152: PIN_ANALOG_3.8 PIN_ANALOG_4.7
N$20
  Bottom 0.152: PIN_ANALOG_3.10 PIN_ANALOG_4.9
N$21
  Bottom 0.152: PIN_ANALOG_3.12 PIN_ANALOG_4.11
N$22
  Bottom 0.152: PIN_ANALOG_3.14 PIN_ANALOG_4.13
N$24
  Bottom 0.152: PIN_ANALOG_4.2 PIN_ANALOG_5.1
N$25
  Bottom 0.152: PIN_ANALOG_4.4 PIN_ANALOG_5.3
N$27
  Bottom 0.152: PIN_ANALOG_4.8 PIN_ANALOG_5.7
N$28
  Bottom 0.152: PIN_ANALOG_4.10 PIN_ANALOG_5.9
N$29
  Bottom 0.152: PIN_ANALOG_4.12 PIN_ANALOG_5.11
N$30
  Bottom 0.152: PIN_ANALOG_4.14 PIN_ANALOG_5.13
N$32
  Bottom 0.152: PIN_ANALOG_5.2 302.89,39.37 PIN_ANALOG_6.1
N$33
  Bottom 0.152: PIN_ANALOG_5.4 302.89,41.91 PIN_ANALOG_6.3
N$35
  Bottom 0.152: PIN_ANALOG_5.8 302.89,46.99 PIN_ANALOG_6.7
N$36
  Bottom 0.152: PIN_ANALOG_5.10 302.89,49.53 PIN_ANALOG_6.9
N$37
  Bottom 0.152: PIN_ANALOG_5.12 302.89,52.07 PIN_ANALOG_6.11
N$38
  Bottom 0.152: PIN_ANALOG_5.14 302.89,54.61 PIN_ANALOG_6.13
N$40
  Bottom 0.152: PIN_ANALOG_7.1 283.85,39.37 299.72,39.37 PIN_ANALOG_6.2
N$41
  Bottom 0.152: PIN_ANALOG_7.3 283.85,41.91 299.72,41.91 PIN_ANALOG_6.4
N$43
  Bottom 0.152: PIN_ANALOG_7.7 283.85,46.99 299.72,46.99 PIN_ANALOG_6.8
N$44
  Bottom 0.152: PIN_ANALOG_7.9 283.85,49.53 299.72,49.53 PIN_ANALOG_6.10
N$45
  Bottom 0.152: PIN_ANALOG_7.11 283.85,52.07 299.72,52.07 PIN_ANALOG_6.12
N$46
  Bottom 0.152: PIN_ANALOG_7.13 283.85,54.61 299.72,54.61 PIN_ANALOG_6.14
N$48
  Bottom 0.152: PIN_ANALOG_7.2 280.67,39.37 264.8,39.37 PIN_ANALOG_8.1
N$49
  Bottom 0.152: PIN_ANALOG_7.4 280.67,41.91 264.8,41.91 PIN_ANALOG_8.3
N$51
  Bottom 0.152: PIN_ANALOG_8.7 264.8,46.99 280.67,46.99 PIN_ANALOG_7.8
N$52
  Bottom 0.152: PIN_ANALOG_8.9 264.8,49.53 280.67,49.53 PIN_ANALOG_7.10
N$53
  Bottom 0.152: PIN_ANALOG_8.11 264.8,52.07 280.67,52.07 PIN_ANALOG_7.12
N$54
  Bottom 0.152: PIN_ANALOG_8.13 264.8,54.61 280.67,54.61 PIN_ANALOG_7.14
N$56
  Bottom 0.152: PIN_ANALOG_9.1 245.75,39.37 261.62,39.37 PIN_ANALOG_8.2
N$57
  Bottom 0.152: PIN_ANALOG_9.3 245.75,41.91 261.62,41.91 PIN_ANALOG_8.4
N$59
  Bottom 0.152: PIN_ANALOG_9.7 245.75,46.99 261.62,46.99 PIN_ANALOG_8.8
N$60
  Bottom 0.152: PIN_ANALOG_9.9 245.75,49.53 261.62,49.53 PIN_ANALOG_8.10
N$61
  Bottom 0.152: PIN_ANALOG_9.11 245.75,52.07 261.62,52.07 PIN_ANALOG_8.12
N$62
  Bottom 0.152: PIN_ANALOG_9.13 245.75,54.61 261.62,54.61 PIN_ANALOG_8.14
N$64
  Bottom 0.152: PIN_ANALOG_9.2 242.57,39.37 226.69,39.37 PIN_ANALOG_10.1
N$65
  Bottom 0.152: PIN_ANALOG_9.4 242.57,41.91 226.69,41.91 PIN_ANALOG_10.3
N$67
  Bottom 0.152: PIN_ANALOG_9.8 242.57,46.99 226.69,46.99 PIN_ANALOG_10.7
N$68
  Bottom 0.152: PIN_ANALOG_9.10 242.57,49.53 226.69,49.53 PIN_ANALOG_10.9
N$69
  Bottom 0.152: PIN_ANALOG_9.12 242.57,52.07 226.69,52.07 PIN_ANALOG_10.11
N$70
  Bottom 0.152: PIN_ANALOG_9.14 242.57,54.61 226.69,54.61 PIN_ANALOG_10.13
N$72
  Bottom 0.152: PIN_ANALOG_11.1 207.64,40.01 223.52,40.01 PIN_ANALOG_10.2
N$73
  Bottom 0.152: PIN_ANALOG_11.3 207.64,42.55 223.52,42.55 PIN_ANALOG_10.4
N$75
  Bottom 0.152: PIN_ANALOG_11.7 207.64,47.62 223.52,47.62 PIN_ANALOG_10.8
N$76
  Bottom 0.152: PIN_ANALOG_11.9 207.64,50.16 223.52,50.16 PIN_ANALOG_10.10
N$77
  Bottom 0.152: PIN_ANALOG_11.11 207.64,52.71 223.52,52.71 PIN_ANALOG_10.12
N$78
  Bottom 0.152: PIN_ANALOG_11.13 207.64,55.25 223.52,55.25 PIN_ANALOG_10.14
N$80
  Bottom 0.152: PIN_ANALOG_12.1 189.23,40.01 204.47,40.01 PIN_ANALOG_11.2
N$81
  Bottom 0.152: PIN_ANALOG_12.3 189.23,42.55 204.47,42.55 PIN_ANALOG_11.4
N$83
  Bottom 0.152: PIN_ANALOG_12.7 189.23,47.62 204.47,47.62 PIN_ANALOG_11.8
N$84
  Bottom 0.152: PIN_ANALOG_12.9 189.23,50.16 204.47,50.16 PIN_ANALOG_11.10
N$85
  Bottom 0.152: PIN_ANALOG_12.11 189.23,52.71 204.47,52.71 PIN_ANALOG_11.12
N$86
  Bottom 0.152: PIN_ANALOG_12.13 189.23,55.25 204.47,55.25 PIN_ANALOG_11.14
N$88
  Bottom 0.152: PIN_ANALOG_13.1 170.18,40.01 186.06,40.01 PIN_ANALOG_12.2
N$89
  Bottom 0.152: PIN_ANALOG_13.3 170.18,42.55 186.06,42.55 PIN_ANALOG_12.4
N$91
  Bottom 0.152: PIN_ANALOG_13.7 170.18,47.62 186.06,47.62 PIN_ANALOG_12.8
N$92
  Bottom 0.152: PIN_ANALOG_13.9 170.18,50.16 186.06,50.16 PIN_ANALOG_12.10
N$93
  Bottom 0.152: PIN_ANALOG_13.11 170.18,52.71 186.06,52.71 PIN_ANALOG_12.12
N$94
  Bottom 0.152: PIN_ANALOG_13.13 170.18,55.25 186.06,55.25 PIN_ANALOG_12.14
N$96
  Bottom 0.152: PIN_ANALOG_14.1 151.13,39.37 167,39.37 PIN_ANALOG_13.2
N$97
  Bottom 0.152: PIN_ANALOG_14.3 151.13,41.91 167,41.91 PIN_ANALOG_13.4
N$99
  Bottom 0.152: PIN_ANALOG_14.7 151.13,46.99 167,46.99 PIN_ANALOG_13.8
N$100
  Bottom 0.152: PIN_ANALOG_14.9 151.13,49.53 167,49.53 PIN_ANALOG_13.10
N$101
  Bottom 0.152: PIN_ANALOG_14.11 151.13,52.07 167,52.07 PIN_ANALOG_13.12
N$102
  Bottom 0.152: PIN_ANALOG_14.13 151.13,54.61 167,54.61 PIN_ANALOG_13.14
N$104
  Bottom 0.152: PIN_ANALOG_14.2 147.95,40.01 132.08,40.01 PIN_ANALOG_15.1
N$105
  Bottom 0.152: PIN_ANALOG_14.4 147.95,42.55 132.08,42.55 PIN_ANALOG_15.3
N$107
  Bottom 0.152: PIN_ANALOG_14.8 147.95,47.62 132.08,47.62 PIN_ANALOG_15.7
N$108
  Bottom 0.152: PIN_ANALOG_14.10 147.95,50.16 132.08,50.16 PIN_ANALOG_15.9
N$109
  Bottom 0.152: PIN_ANALOG_14.12 147.95,52.71 132.08,52.71 PIN_ANALOG_15.11
N$110
  Bottom 0.152: PIN_ANALOG_14.14 147.95,55.25 132.08,55.25 PIN_ANALOG_15.13
N$112
  Bottom 0.152: PIN_ANALOG_16.1 113.03,40.01 128.91,40.01 PIN_ANALOG_15.2
N$113
  Bottom 0.152: PIN_ANALOG_16.3 113.03,42.55 128.91,42.55 PIN_ANALOG_15.4
N$115
  Bottom 0.152: PIN_ANALOG_16.7 113.03,47.62 128.91,47.62 PIN_ANALOG_15.8
N$116
  Bottom 0.152: PIN_ANALOG_16.9 113.03,50.16 128.91,50.16 PIN_ANALOG_15.10
N$117
  Bottom 0.152: PIN_ANALOG_16.11 113.03,52.71 128.91,52.71 PIN_ANALOG_15.12
N$118
  Bottom 0.152: PIN_ANALOG_16.13 113.03,55.25 128.91,55.25 PIN_ANALOG_15.14
N$120
  Bottom 0.152: PIN_ANALOG_17.1 93.98,40.01 109.85,40.01 PIN_ANALOG_16.2
N$121
  Bottom 0.152: PIN_ANALOG_17.3 93.98,42.55 109.85,42.55 PIN_ANALOG_16.4
N$123
  Bottom 0.152: PIN_ANALOG_17.7 93.98,47.62 109.85,47.62 PIN_ANALOG_16.8
N$124
  Bottom 0.152: PIN_ANALOG_17.9 93.98,50.16 109.85,50.16 PIN_ANALOG_16.10
N$125
  Bottom 0.152: PIN_ANALOG_17.11 93.98,52.71 109.85,52.71 PIN_ANALOG_16.12
N$126
  Bottom 0.152: PIN_ANALOG_17.13 93.98,55.25 109.85,55.25 PIN_ANALOG_16.14
N$128
  Bottom 0.152: PIN_ANALOG_18.1 74.93,40.01 90.81,40.01 PIN_ANALOG_17.2
N$129
  Bottom 0.152: PIN_ANALOG_18.3 74.93,42.55 90.81,42.55 PIN_ANALOG_17.4
N$131
  Bottom 0.152: PIN_ANALOG_18.7 74.93,47.62 90.81,47.62 PIN_ANALOG_17.8
N$132
  Bottom 0.152: PIN_ANALOG_18.9 74.93,50.16 90.81,50.16 PIN_ANALOG_17.10
N$133
  Bottom 0.152: PIN_ANALOG_18.11 74.93,52.71 90.81,52.71 PIN_ANALOG_17.12
N$134
  Bottom 0.152: PIN_ANALOG_18.13 74.93,55.25 90.81,55.25 PIN_ANALOG_17.14
N$136
  Bottom 0.152: PIN_ANALOG_19.1 55.88,40.01 71.75,40.01 PIN_ANALOG_18.2
N$137
  Bottom 0.152: PIN_ANALOG_19.3 55.88,42.55 71.75,42.55 PIN_ANALOG_18.4
N$139
  Bottom 0.152: PIN_ANALOG_19.7 55.88,47.62 71.75,47.62 PIN_ANALOG_18.8
N$140
  Bottom 0.152: PIN_ANALOG_19.9 55.88,50.16 71.75,50.16 PIN_ANALOG_18.10
N$141
  Bottom 0.152: PIN_ANALOG_19.11 55.88,52.71 71.75,52.71 PIN_ANALOG_18.12
N$142
  Bottom 0.152: PIN_ANALOG_19.13 55.88,55.25 71.75,55.25 PIN_ANALOG_18.14
N$144
  Bottom 0.152: PIN_ANALOG_19.2 52.7,40.01 36.83,40.01 PIN_ANALOG_20.1
N$145
  Bottom 0.152: PIN_ANALOG_19.4 52.7,42.55 36.83,42.55 PIN_ANALOG_20.3
N$147
  Bottom 0.152: PIN_ANALOG_19.8 52.7,47.62 36.83,47.62 PIN_ANALOG_20.7
N$148
  Bottom 0.152: PIN_ANALOG_19.10 52.7,50.16 36.83,50.16 PIN_ANALOG_20.9
N$149
  Bottom 0.152: PIN_ANALOG_19.12 52.7,52.71 36.83,52.71 PIN_ANALOG_20.11
N$150
  Bottom 0.152: PIN_ANALOG_19.14 52.7,55.25 36.83,55.25 PIN_ANALOG_20.13
N$152
  Bottom 0.152: PIN_ANALOG_21.1 17.78,39.37 33.65,39.37 PIN_ANALOG_20.2
N$153
  Bottom 0.152: PIN_ANALOG_21.3 17.78,41.91 33.65,41.91 PIN_ANALOG_20.4
N$155
  Bottom 0.152: PIN_ANALOG_21.7 17.78,46.99 33.65,46.99 PIN_ANALOG_20.8
N$156
  Bottom 0.152: PIN_ANALOG_21.9 17.78,49.53 33.65,49.53 PIN_ANALOG_20.10
N$157
  Bottom 0.152: PIN_ANALOG_21.11 17.78,52.07 33.65,52.07 PIN_ANALOG_20.12
N$158
  Bottom 0.152: PIN_ANALOG_21.13 17.78,54.61 33.65,54.61 PIN_ANALOG_20.14

### Text on the board
tPlace: GND | GND | RX | RX L | TX | TX L | TRG / IN | TRIG / OUT | TRG / OUT | TRIG / IN | 5V | 5V | SPR R | SPR L R | CLK / IN | CLK / OUT | GND | AIN1 | 3.3V | 88 | 121 / ExtTrig | 89 | GND | 90 | 91 | GND | 100 | 101 | GND | Trig board
bPlace: v9.02_rack_backplane_v1.01 | by Dr. Andy Haas